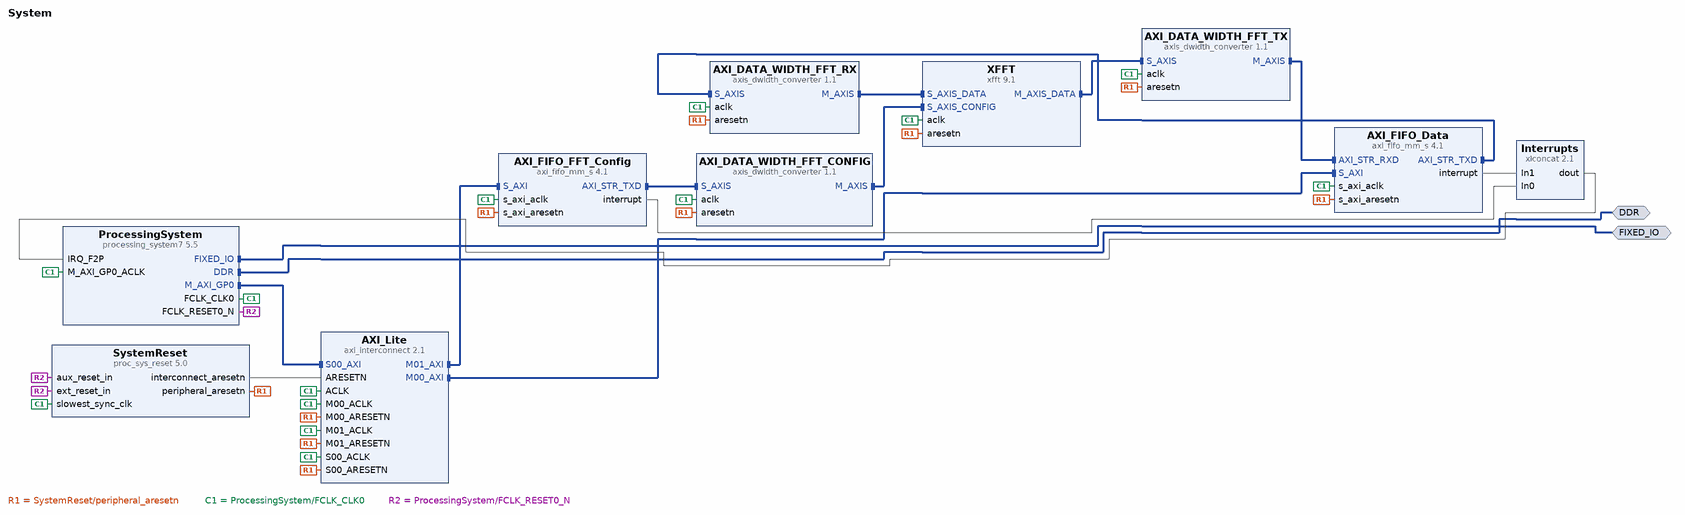
[diagram p0: block diagram of the top level]
# Vivado block design System, xc7z010clg400-1, Vivado 2018.2
create_bd_design System

create_bd_intf_port -mode Master -vlnv xilinx.com:display_processing_system7:fixedio_rtl:1.0 FIXED_IO
create_bd_intf_port -mode Master -vlnv xilinx.com:interface:ddrx_rtl:1.0 DDR

create_bd_cell -type ip -vlnv xilinx.com:ip:processing_system7:5.5 ProcessingSystem
set_property -dict [list \
  CONFIG.PCW_UIPARAM_DDR_FREQ_MHZ 525.000000 \
  CONFIG.PCW_CRYSTAL_PERIPHERAL_FREQMHZ 50.000000 \
  CONFIG.PCW_APU_PERIPHERAL_FREQMHZ 650.000000 \
  CONFIG.PCW_UART_PERIPHERAL_FREQMHZ 50 \
  CONFIG.PCW_FPGA0_PERIPHERAL_FREQMHZ 100.000000 \
  CONFIG.PCW_FPGA1_PERIPHERAL_FREQMHZ 175.000000 \
  CONFIG.PCW_FPGA2_PERIPHERAL_FREQMHZ 12.288000 \
  CONFIG.PCW_FPGA3_PERIPHERAL_FREQMHZ 100.000000 \
  CONFIG.PCW_USE_FABRIC_INTERRUPT 1 \
  CONFIG.PCW_IRQ_F2P_INTR 1 \
  CONFIG.PCW_GP0_EN_MODIFIABLE_TXN 0 \
  CONFIG.PCW_GP1_EN_MODIFIABLE_TXN 0 \
  CONFIG.PCW_IMPORT_BOARD_PRESET /home/daniel/Schreibtisch/Git/Zybo/Misc/Zybo.xml \
  CONFIG.PCW_PERIPHERAL_BOARD_PRESET part0 \
  CONFIG.PCW_PRESET_BANK1_VOLTAGE {LVCMOS 1.8V} \
  CONFIG.PCW_UIPARAM_DDR_PARTNO {MT41K128M16 JT-125} \
  CONFIG.PCW_QSPI_PERIPHERAL_ENABLE 0 \
  CONFIG.PCW_ENET0_PERIPHERAL_ENABLE 0 \
  CONFIG.PCW_SD0_PERIPHERAL_ENABLE 0 \
  CONFIG.PCW_UART1_PERIPHERAL_ENABLE 1 \
  CONFIG.PCW_UART1_UART1_IO {MIO 48 .. 49} \
  CONFIG.PCW_USB0_PERIPHERAL_ENABLE 0 \
  CONFIG.PCW_GPIO_PERIPHERAL_ENABLE 1 \
  CONFIG.PCW_GPIO_MIO_GPIO_ENABLE 0 \
  CONFIG.PCW_FCLK1_PERIPHERAL_CLKSRC {DDR PLL} \
  CONFIG.PCW_FCLK2_PERIPHERAL_CLKSRC {ARM PLL} \
  CONFIG.preset None \
] [get_bd_cells ProcessingSystem]
# 339 more settings of ProcessingSystem are not shown: defaults, MIO pin electricals, DDR timing, and values the tool derives
create_bd_cell -type ip -vlnv xilinx.com:ip:proc_sys_reset:5.0 SystemReset
create_bd_cell -type ip -vlnv xilinx.com:ip:xlconcat:2.1 Interrupts
set_property -dict {CONFIG.NUM_PORTS 2 CONFIG.dout_width 2} [get_bd_cells Interrupts]
create_bd_cell -type ip -vlnv xilinx.com:ip:axi_fifo_mm_s:4.1 AXI_FIFO_Data
set_property -dict [list \
  CONFIG.C_RX_FIFO_PE_THRESHOLD 2 \
  CONFIG.C_RX_FIFO_PF_THRESHOLD 507 \
  CONFIG.C_TX_FIFO_PE_THRESHOLD 2 \
  CONFIG.C_TX_FIFO_PF_THRESHOLD 507 \
  CONFIG.C_RX_FIFO_DEPTH 2048 \
  CONFIG.C_TX_FIFO_DEPTH 2048 \
  CONFIG.C_HAS_AXIS_TUSER false \
  CONFIG.C_HAS_AXIS_TDEST false \
] [get_bd_cells AXI_FIFO_Data]
create_bd_cell -type ip -vlnv xilinx.com:ip:axi_fifo_mm_s:4.1 AXI_FIFO_FFT_Config
create_bd_cell -type ip -vlnv xilinx.com:ip:axis_dwidth_converter:1.1 AXI_DATA_WIDTH_FFT_TX
set_property -dict {CONFIG.M_TDATA_NUM_BYTES 4} [get_bd_cells AXI_DATA_WIDTH_FFT_TX]
create_bd_cell -type ip -vlnv xilinx.com:ip:axis_dwidth_converter:1.1 AXI_DATA_WIDTH_FFT_CONFIG
set_property -dict {CONFIG.M_TDATA_NUM_BYTES 2} [get_bd_cells AXI_DATA_WIDTH_FFT_CONFIG]
create_bd_cell -type ip -vlnv xilinx.com:ip:axis_dwidth_converter:1.1 AXI_DATA_WIDTH_FFT_RX
set_property -dict {CONFIG.M_TDATA_NUM_BYTES 8 CONFIG.HAS_MI_TKEEP 1} [get_bd_cells AXI_DATA_WIDTH_FFT_RX]
create_bd_cell -type ip -vlnv xilinx.com:ip:axi_interconnect:2.1 AXI_Lite
set_property -dict {CONFIG.NUM_MI 2 CONFIG.SYNCHRONIZATION_STAGES 2} [get_bd_cells AXI_Lite]
create_bd_cell -type ip -vlnv xilinx.com:ip:xfft:9.1 XFFT
set_property -dict [list \
  CONFIG.transform_length 64 \
  CONFIG.implementation_options pipelined_streaming_io \
  CONFIG.run_time_configurable_transform_length true \
  CONFIG.data_format floating_point \
  CONFIG.phase_factor_width 24 \
  CONFIG.scaling_options scaled \
  CONFIG.aresetn true \
  CONFIG.output_ordering natural_order \
  CONFIG.number_of_stages_using_block_ram_for_data_and_phase_factors 0 \
] [get_bd_cells XFFT]

# ---- connections ----

connect_bd_intf_net [get_bd_intf_pins AXI_Lite/M00_AXI] [get_bd_intf_pins AXI_FIFO_Data/S_AXI]
connect_bd_intf_net [get_bd_intf_pins AXI_DATA_WIDTH_FFT_CONFIG/S_AXIS] [get_bd_intf_pins AXI_FIFO_FFT_Config/AXI_STR_TXD]
connect_bd_intf_net -intf_net axis_dwidth_converter_0_M_AXIS1 [get_bd_intf_pins XFFT/S_AXIS_CONFIG] [get_bd_intf_pins AXI_DATA_WIDTH_FFT_CONFIG/M_AXIS]
connect_bd_intf_net [get_bd_intf_pins AXI_DATA_WIDTH_FFT_TX/S_AXIS] [get_bd_intf_pins XFFT/M_AXIS_DATA]
connect_bd_intf_net [get_bd_intf_pins AXI_DATA_WIDTH_FFT_RX/M_AXIS] [get_bd_intf_pins XFFT/S_AXIS_DATA]
connect_bd_intf_net [get_bd_intf_pins AXI_FIFO_Data/AXI_STR_RXD] [get_bd_intf_pins AXI_DATA_WIDTH_FFT_TX/M_AXIS]
connect_bd_intf_net [get_bd_intf_pins AXI_FIFO_Data/AXI_STR_TXD] [get_bd_intf_pins AXI_DATA_WIDTH_FFT_RX/S_AXIS]
connect_bd_intf_net -intf_net Processing_System_0_M_AXI_GP0 [get_bd_intf_pins ProcessingSystem/M_AXI_GP0] [get_bd_intf_pins AXI_Lite/S00_AXI]
connect_bd_intf_net [get_bd_intf_pins AXI_Lite/M01_AXI] [get_bd_intf_pins AXI_FIFO_FFT_Config/S_AXI]
connect_bd_intf_net -intf_net processing_system7_0_FIXED_IO [get_bd_intf_ports FIXED_IO] [get_bd_intf_pins ProcessingSystem/FIXED_IO]
connect_bd_intf_net -intf_net Processing_System_0_DDR [get_bd_intf_ports DDR] [get_bd_intf_pins ProcessingSystem/DDR]
connect_bd_net -net rst_processing_system7_0_100M_peripheral_aresetn [get_bd_pins SystemReset/peripheral_aresetn] \
  [get_bd_pins AXI_FIFO_Data/s_axi_aresetn] [get_bd_pins AXI_FIFO_FFT_Config/s_axi_aresetn] \
  [get_bd_pins AXI_DATA_WIDTH_FFT_TX/aresetn] [get_bd_pins AXI_DATA_WIDTH_FFT_CONFIG/aresetn] \
  [get_bd_pins AXI_DATA_WIDTH_FFT_RX/aresetn] [get_bd_pins XFFT/aresetn] [get_bd_pins AXI_Lite/S00_ARESETN] \
  [get_bd_pins AXI_Lite/M00_ARESETN] [get_bd_pins AXI_Lite/M01_ARESETN]
connect_bd_net -net processing_system7_0_FCLK_CLK0 [get_bd_pins ProcessingSystem/FCLK_CLK0] \
  [get_bd_pins ProcessingSystem/M_AXI_GP0_ACLK] [get_bd_pins SystemReset/slowest_sync_clk] \
  [get_bd_pins AXI_FIFO_Data/s_axi_aclk] [get_bd_pins AXI_FIFO_FFT_Config/s_axi_aclk] \
  [get_bd_pins AXI_DATA_WIDTH_FFT_TX/aclk] [get_bd_pins AXI_DATA_WIDTH_FFT_CONFIG/aclk] \
  [get_bd_pins AXI_DATA_WIDTH_FFT_RX/aclk] [get_bd_pins XFFT/aclk] [get_bd_pins AXI_Lite/ACLK] \
  [get_bd_pins AXI_Lite/S00_ACLK] [get_bd_pins AXI_Lite/M00_ACLK] [get_bd_pins AXI_Lite/M01_ACLK]
connect_bd_net -net rst_processing_system7_0_100M_interconnect_aresetn [get_bd_pins SystemReset/interconnect_aresetn] [get_bd_pins AXI_Lite/ARESETN]
connect_bd_net -net xlconcat_0_dout [get_bd_pins Interrupts/dout] [get_bd_pins ProcessingSystem/IRQ_F2P]
connect_bd_net [get_bd_pins ProcessingSystem/FCLK_RESET0_N] [get_bd_pins SystemReset/ext_reset_in] [get_bd_pins SystemReset/aux_reset_in]
connect_bd_net [get_bd_pins AXI_FIFO_FFT_Config/interrupt] [get_bd_pins Interrupts/In0]
connect_bd_net [get_bd_pins AXI_FIFO_Data/interrupt] [get_bd_pins Interrupts/In1]

# ---- address map ----
assign_bd_address -offset 0x43C00000 -range 64K -target_address_space [get_bd_addr_spaces ProcessingSystem/Data] [get_bd_addr_segs AXI_FIFO_Data/S_AXI/Mem0]
assign_bd_address -offset 0x43C10000 -range 64K -target_address_space [get_bd_addr_spaces ProcessingSystem/Data] [get_bd_addr_segs AXI_FIFO_FFT_Config/S_AXI/Mem0]

validate_bd_design
save_bd_design
